# Altium schematic sheet OTP4.SchDoc
size Letter
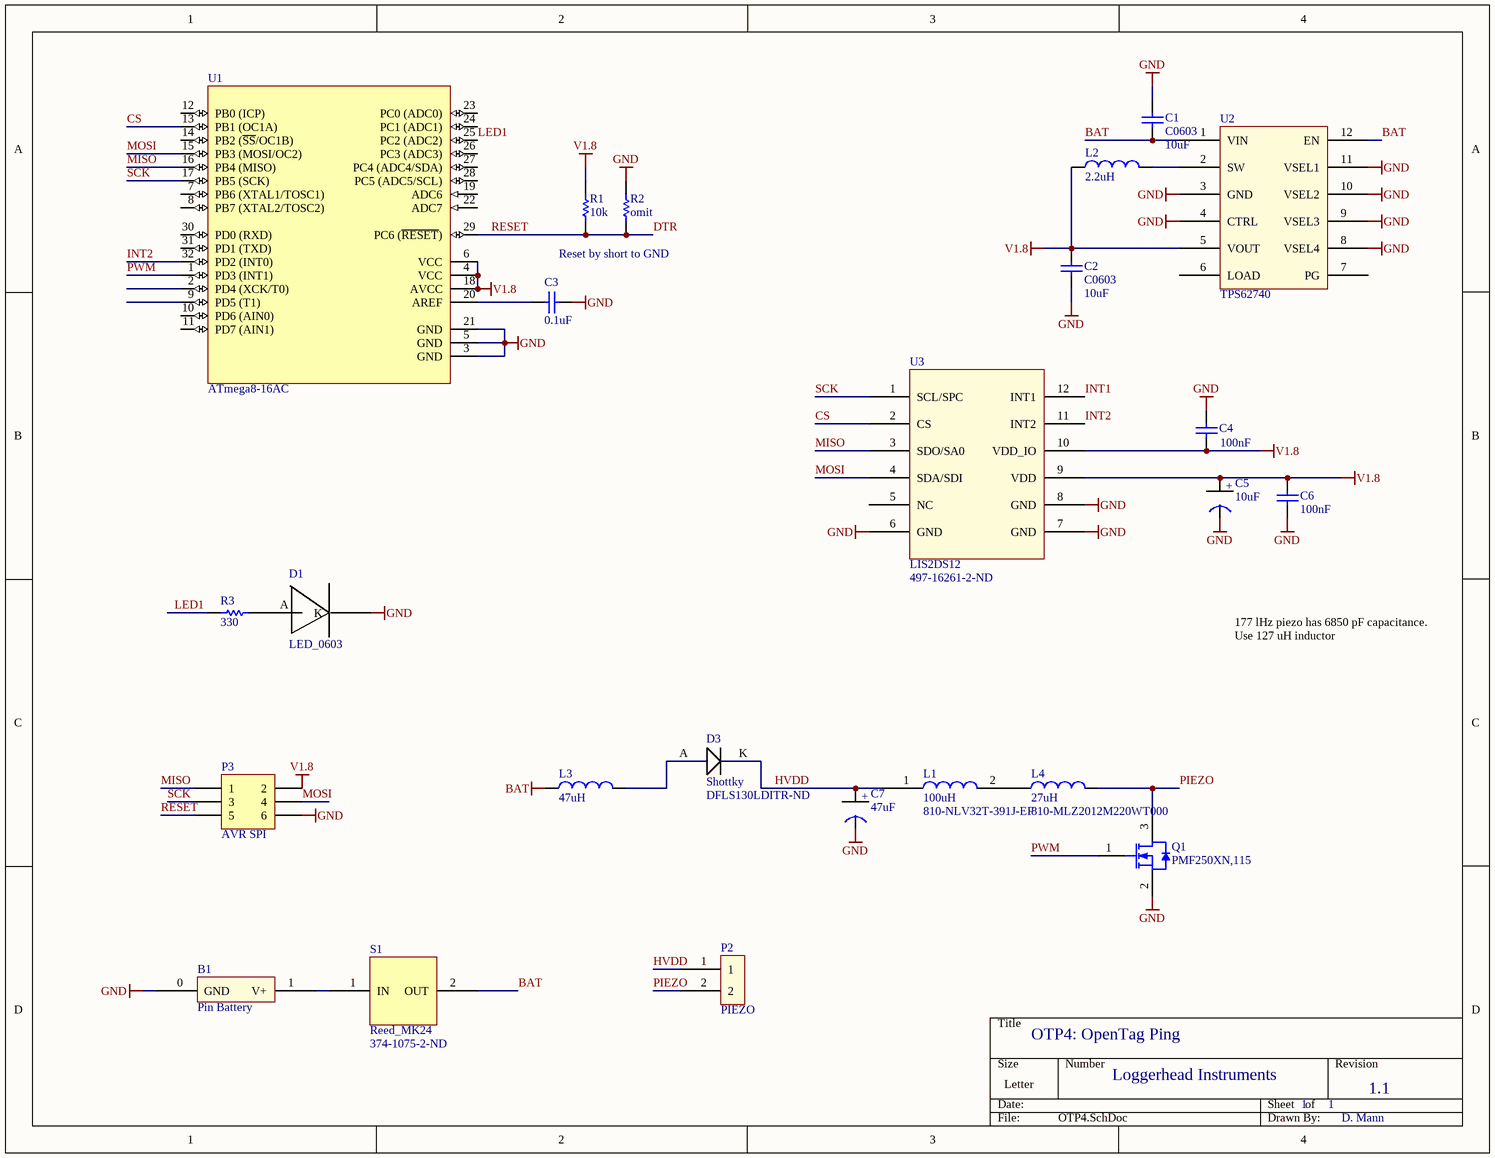
[diagram p0: OTP4.SchDoc]

## Parts
B1  Pin Battery  [Battery_Pin]
C1  C0603  value 10uF  [0603]
C2  C0603  value 10uF  [0603]
C3  0.1uF  [0402]
C4  100nF  [0402]
C5  10uF  [Tant0805]
C6  100nF  [0402]
C7  47uF  [Tant0805]
D1  LED_0603  [Diode0603]
D3  Shottky  Supplier Part Number 1: DFLS130LDITR-ND  [DFLS130]
L1  100uH  Supplier Part Number 1: 810-NLV32T-391J-EF  [Inductor_NLV32T]
L2  2.2uH  [Inductor KLZ1608AHR]
L3  47uH  [Inductor KLZ1608AHR]
L4  27uH  Supplier Part Number 1: 810-MLZ2012M220WT000  [Inductor MLZ2012M220WT000]
P2  PIEZO  [PIEZO]
P3  AVR SPI  [HDR2X3]
Q1  PMF250XN,115  [NXP-SOT323_N]
R1  10k  [3-0603]
R2  omit  [3-0603]
R3  330  [3-0603]
S1  Reed_MK24  Supplier Part Number 1: 374-1075-2-ND  [Reed MK24-B-3]
U1  ATmega8-16AC  [32M1-A_M]
U2  TPS62740  [TPS6274x]
U3  LIS2DS12  Supplier Part Number 1: 497-16261-2-ND  [LGA-12]

## Nets
BAT: C1.1 L3.1 S1.2(OUT) U2.1(VIN) U2.12(EN)
GND: B1.0(GND) C1.2 C2.1 C3.2 C4.2 C5.1(GND) C6.2 C7.1(GND) D1.K P3.6 Q1.2(S) R2.2 U1.3(GND) U1.5(GND) U1.21(GND) U2.3(GND) U2.4(CTRL) U2.8(VSEL4) U2.9(VSEL3) U2.10(VSEL2) U2.11(VSEL1) U3.6(GND) U3.7(GND) U3.8(GND)
V1.8: C2.2 C4.1 C5.2(+) C6.1 L2.1 P3.2 R1.2 U1.4(VCC) U1.6(VCC) U1.18(AVCC) U2.5(VOUT) U3.9(VDD) U3.10(VDD_IO)
CS: U1.13(PB1_(OC1A)) U3.2(CS)
DTR: P3.5 R1.1 R2.1 U1.29(PC6_(~{RESET}))  [also labelled RESET]
HVDD: C7.2(+) D3.K L1.1 P2.1
INT1: U3.12(INT1)
INT2: U1.32(PD2_(INT0)) U3.11(INT2)
LED1: R3.1 U1.25(PC2_(ADC2))
MISO: P3.1 U1.16(PB4_(MISO)) U3.3(SDO/SA0)
MOSI: P3.4 U1.15(PB3_(MOSI/OC2)) U3.4(SDA/SDI)
PIEZO: L4.2 P2.2 Q1.3(D)
PWM: Q1.1(G) U1.1(PD3_(INT1))
SCK: P3.3 U1.17(PB5_(SCK)) U3.1(SCL/SPC)
NetB1_1: B1.1(V+) S1.1(IN)
NetC3_1: C3.1 U1.20(AREF)
NetD1_A: D1.A R3.2
NetD3_A: D3.A L3.2
NetL1_2: L1.2 L4.1
NetL2_2: L2.2 U2.2(SW)

Not connected (* = marked no-connect by the designer): U1 2(PD4_(XCK/T0)) 7(PB6_(XTAL1/TOSC1)) 8(PB7_(XTAL2/TOSC2)) 9(PD5_(T1)) 10(PD6_(AIN0)) 11(PD7_(AIN1)) 12(PB0_(ICP)) 14(PB2_(~{SS}/OC1B)) 19(ADC6) 22(ADC7) 23(PC0_(ADC0)) 24(PC1_(ADC1)) 26(PC3_(ADC3)) 27(PC4_(ADC4/SDA)) 28(PC5_(ADC5/SCL)) 30(PD0_(RXD)) 31(PD1_(TXD)); U2 6(LOAD) 7(PG); U3 5(NC)

## Notes on the sheet
- Reset by short to GND
- 177 lHz piezo has 6850 pF capacitance.
  Use 127 uH inductor
- OTP4: OpenTag Ping
- Loggerhead Instruments
- 1
- 1.1
- D. Mann

## Library data of the parts
B1 = Battery_Pin
C1 C2 = C0603: Ceramic Chip Capacitor - Standard; Note: Footprint corresponds to dimensions for bulk cassette packaging. This case size has tightened tolerances.; Published: 17-Jul-2002; LatestRevisionDate: 19-Mar-2004; LatestRevisionNote: Silkscreen size reduced.; DatasheetDocument: Mar-2001; PackageDocument: Mar-2001; PackageReference: 0603; Publisher: Altium Limited; Code_JEITA: 0603; Code_IPC: 1608 [0603]; ComponentLink1Description: Manufacturer Link; ComponentLink1URL: http://www.kemet.com/; ComponentLink2Description: Datasheet; ComponentLink2URL: http://www.kemet.com/kemet/web/homepage/kechome.nsf/vapubfilesname/F3102TA.pdf/$file/F3102TA.pdf
C3 = C0402: Ceramic Chip Capacitor - Standard; Note: Footprint corresponds to dimensions for bulk cassette packaging. This case size has tightened tolerances.; Published: 17-Jul-2002; LatestRevisionDate: 19-Mar-2004; LatestRevisionNote: Silkscreen size reduced.; DatasheetDocument: Mar-2001; PackageDocument: Mar-2001; PackageReference: 0402; Publisher: Altium Limited; Code_JEITA: 0402; Code_IPC: 1005 [0402]; ComponentLink1Description: Manufacturer Link; ComponentLink1URL: http://www.kemet.com/; ComponentLink2Description: Datasheet; ComponentLink2URL: http://www.kemet.com/kemet/web/homepage/kechome.nsf/vapubfilesname/F3102TA.pdf/$file/F3102TA.pdf; Value: 0.1uF
C4 C6 = C0402: Ceramic Chip Capacitor - Standard; Note: Footprint corresponds to dimensions for bulk cassette packaging. This case size has tightened tolerances.; Value: 100pF; Published: 17-Jul-2002; LatestRevisionDate: 19-Mar-2004; LatestRevisionNote: Silkscreen size reduced.; DatasheetDocument: Mar-2001; PackageDocument: Mar-2001; PackageReference: 0402; Publisher: Altium Limited; Code_JEITA: 0402; Code_IPC: 1005 [0402]; ComponentLink1Description: Manufacturer Link; ComponentLink1URL: http://www.kemet.com/; ComponentLink2Description: Datasheet; ComponentLink2URL: http://www.kemet.com/kemet/web/homepage/kechome.nsf/vapubfilesname/F3102TA.pdf/$file/F3102TA.pdf
C5 = Tant0805: Value: 10uF
C7 = Tant0805: Value: 10uF
D3 = DFLS130: Supplier 1: Digi-Key
L1 = Inductor_NLV32T: Supplier 1: Mouser
L2 L3 = Inductor KLZ1608: Supplier 1: Mouser; Supplier Part Number 1: 810-KLZ1608AHR2R2WTD
L4 = Inductor MLZ2012M220WT000: Supplier 1: Mouser
P3 = Header 3X2: Header, 3-Pin, Dual row; LatestRevisionDate: 17-Jul-2002; LatestRevisionNote: Re-released for DXP Platform.; Publisher: Altium Limited
Q1 = PMF250XN,115: N-Channel Trench MOSFET, 30 V, 0.9 A, -55 to 150 degC, 3-Pin SOT323, Tape and Reel; Manufacturer: NXP Semiconductors; Channel Type: N; Ciss [typ] (pF): 50; Coss [typ] (pF): 10; ID [max] (A): 0.9; Packing: Tape & Reel; VDS [max] (V): 30; VGSth [typ] (V): 1; DatasheetVersion: Rev. 1; PackageVersion: 06-03-16, 03/2006; PackageReference: SOT323; PackageDescription: 3-Pin Small Outline Transistor Package, Body 2 x 1.25 mm, Pitch 0.65 mm; Supplier 1: Digi-Key; Supplier Part Number 1: 568-10784-2-ND; Supplier 2: Digi-Key; Supplier Part Number 2: 568-10784-1-ND; Supplier 3: Digi-Key; Supplier Part Number 3: 568-10784-6-ND; Supplier 4: Mouser; Supplier Part Number 4: 771-PMF250XN,115; Mounting Technology: Surface Mount; Code_JEITA: SC-70; PartNumber: PMF250XN,115; ComponentLink1Description: Manufacturer URL; ComponentLink1URL: http://www.nxp.com/; ComponentLink2Description: Datasheet; ComponentLink2URL: http://www.nxp.com/documents/data_sheet/PMF250XN.pdf; ComponentLink3Description: Package Specification; ComponentLink3URL: http://www.nxp.com/documents/outline_drawing/sot323_po.pdf
R1-R3 = ERJ3RK: Precision Thick Film Chip Resistor, 10 Ohm to 1M Ohm Range, 1% and 0.5% Tolerance, 0603 Size, 0.063 W; Published: 17-Dec-2003; LatestRevisionDate: 19-Mar-2004; LatestRevisionNote: Silkscreen size reduced.; PackageDocument: Mar-2003; PackageReference: 3-0603; Publisher: Altium Limited; Code_IPC: 1608 [0603]; ComponentLink1Description: Manufacturer Link; ComponentLink1URL: http://www.panasonic.com/industrial/components/resistive_products.htm; ComponentLink2Description: Datasheet; ComponentLink2URL: http://www.panasonic.com/industrial/components/pdf/AOA0000CE2.pdf
U1 = ATmega8-16AC: 8-Bit AVR Microcontroller with 8K Bytes of In-System Programmable Flash Memory; Published: 17-Sep-2003; LatestRevisionDate: 13-Apr-2006; LatestRevisionNote: IPC-7351 Footprint Added.; DatasheetVersion: 2486H-AVR-09/02; PackageVersion: revB, Oct-2001; PackageReference: 32A; Publisher: Altium Limited; PackageDescription: 32-Pin Thin Quad Flat Pack 0.8 mm Pitch; Code_JEDEC: MS-026-ABA; ComponentLink1Description: Manufacturer Link; ComponentLink1URL: http://www.atmel.com; ComponentLink2Description: Datasheet; ComponentLink2URL: http://www.atmel.com/dyn/resources/prod_documents/doc2486.pdf
U2 = TPS6274x: Supplier 1: Farnell
S1 = Reed_MK24: Supplier 1: Digi-Key
U3 = LIS2DS12: Supplier 1: Digi-Key